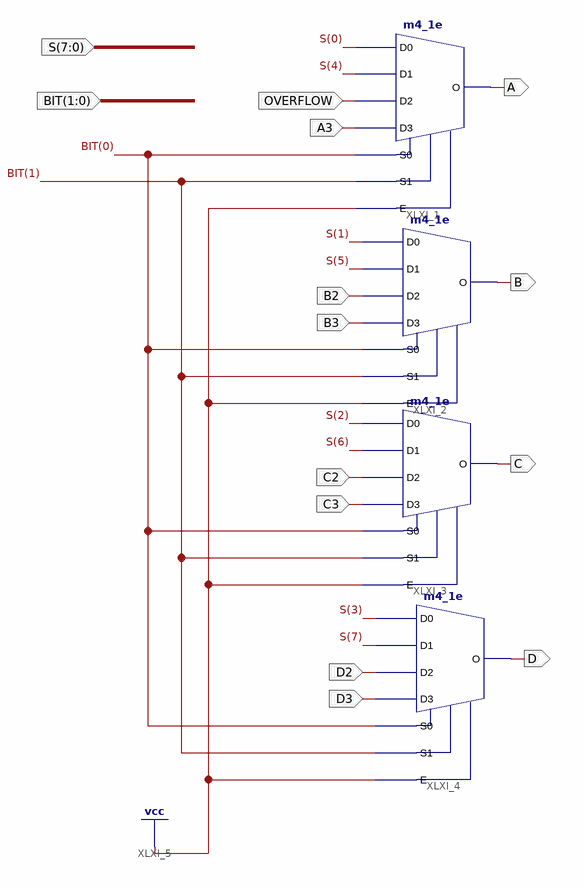
[diagram p0: schematic sheet 1]
// Xilinx ISE schematic Mux_4_4_11.sch (spartan6) as structural Verilog: 4 symbols, 14 ports
module Mux_4_4_11 (
  input  OVERFLOW,
  input  A3,
  input  B2,
  input  B3,
  input  C2,
  input  C3,
  input  D2,
  input  D3,
  input  [7:0] S,
  input  [1:0] BIT,
  output D,
  output C,
  output B,
  output A
);

  m4_1e XLXI_1 (.D0(S[0]), .D1(S[4]), .D2(OVERFLOW), .D3(A3), .E(1'b1), .S0(BIT[0]), .S1(BIT[1]), .O(A));
  m4_1e XLXI_2 (.D0(S[1]), .D1(S[5]), .D2(B2), .D3(B3), .E(1'b1), .S0(BIT[0]), .S1(BIT[1]), .O(B));
  m4_1e XLXI_3 (.D0(S[2]), .D1(S[6]), .D2(C2), .D3(C3), .E(1'b1), .S0(BIT[0]), .S1(BIT[1]), .O(C));
  m4_1e XLXI_4 (.D0(S[3]), .D1(S[7]), .D2(D2), .D3(D3), .E(1'b1), .S0(BIT[0]), .S1(BIT[1]), .O(D));
endmodule
